# Altium schematic sheet ui_audio.SchDoc: mcHF Pro Transceiver UI board
size A3; Author: Krassi Atanassov; CompanyName: MØNKA; Engineer: For radio amateurs experimentation, non-commercial use only. Thank you!; Revision: 0.8.5; SheetTotal: 13
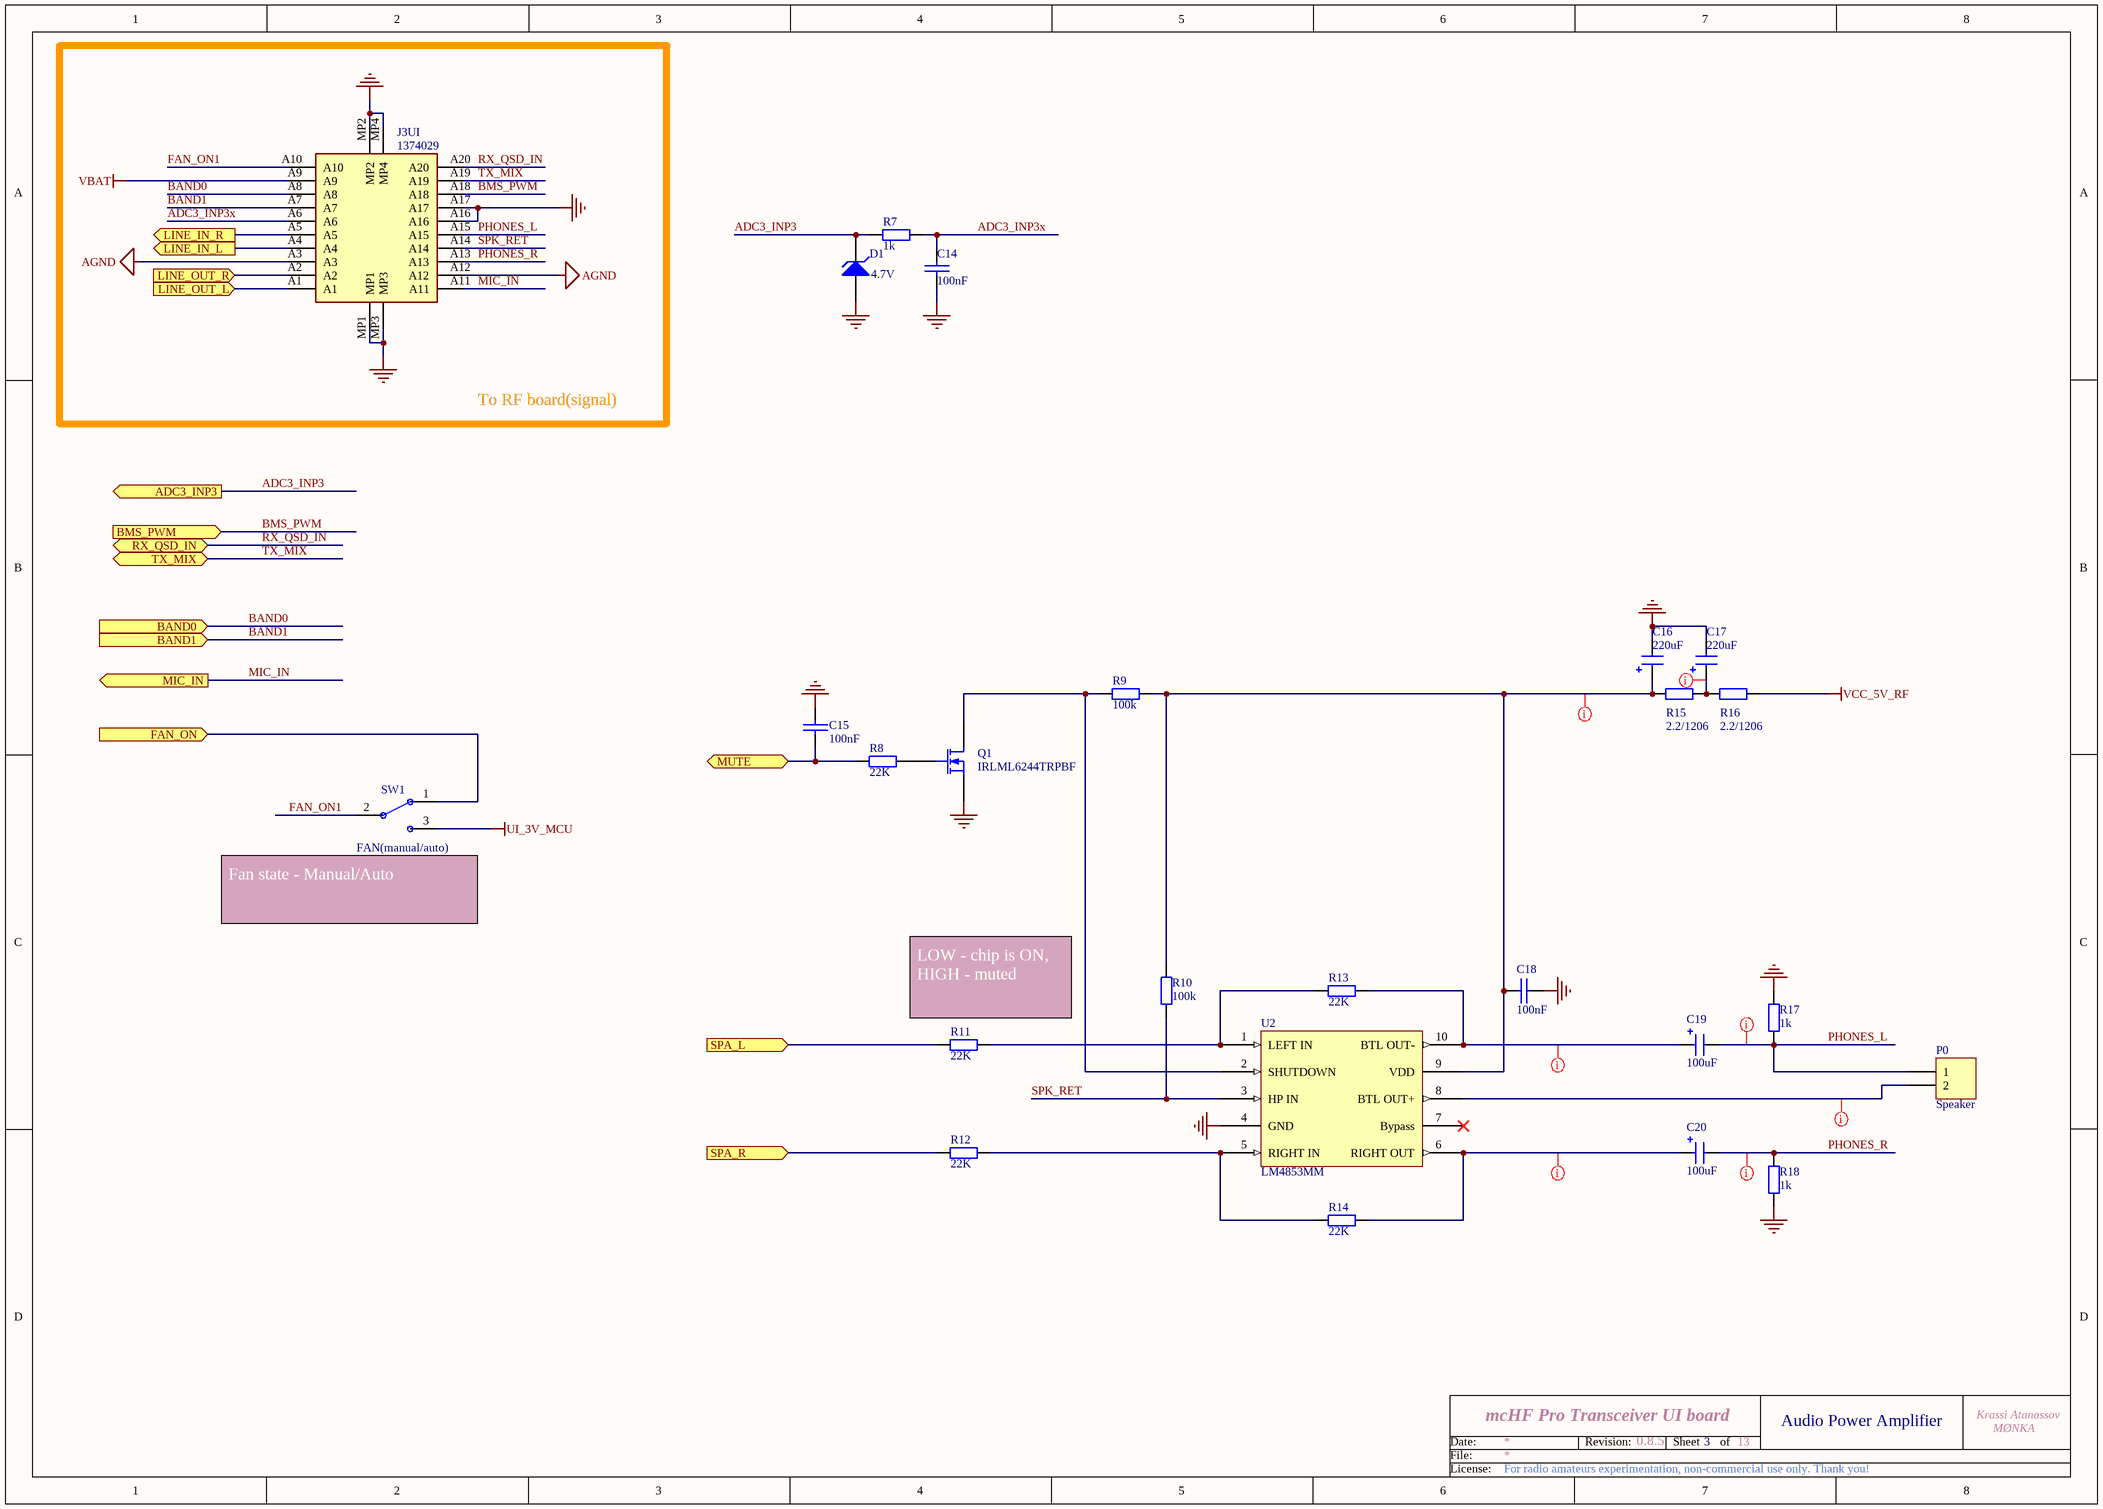
[diagram p0: ui_audio.SchDoc]

## Parts
C14  100nF  [0805]
C15  100nF  [0805]
C16  220uF  [CAP_ALUM_Pro]
C17  220uF  [CAP_ALUM_Pro]
C18  100nF  [0805]
C19  100uF  [CAP_ALUM_Pro]
C20  100uF  [CAP_ALUM_Pro]
D1  4.7V  [0805P]
J3UI  1374029  [1373866]
P0  Speaker  [MHDR1X2_m]
Q1  IRLML6244TRPBF  [SOT-23]
R7  1k  [0805]
R8  22K  [0805]
R9  100k  [0805]
R10  100k  [0805]
R11  22K  [0805]
R12  22K  [0805]
R13  22K  [0805]
R14  22K  [0805]
R15  2.2/1206  [1206]
R16  2.2/1206  [1206]
R17  1k  [0805]
R18  1k  [0805]
SW1  FAN(manual/auto)  [SW3]
U2  LM4853MM  [SLAB-MSOP-10_N]

## Blocks framed on the sheet
To RF board(signal): J3UI

## Ports
ADC3_INP3 (out), BAND0 (in), BAND1 (in), BMS_PWM (in), FAN_ON (in), LINE_IN_L (out), LINE_IN_R (out), LINE_OUT_L (in), LINE_OUT_R (in), MIC_IN (out), MUTE (bidir), RX_QSD_IN (bidir), SPA_L (in), SPA_R (in), TX_MIX (bidir)

## Nets
AGND: J3UI.A3 J3UI.A12
GND: C14.1 C15.1 C16.2 C17.2 C18.1 D1.1(A) J3UI.A16 J3UI.A17 J3UI.MP1 J3UI.MP2 J3UI.MP3 J3UI.MP4 Q1.2(S) R17.2 R18.1 U2.4(GND)
UI_3V_MCU: SW1.3
VBAT: J3UI.A9
VCC_5V_RF: R16.1
ADC3_INP3: D1.2(K) R7.2 ; port ADC3_INP3
ADC3_INP3x: C14.2 J3UI.A6 R7.1
BAND0: J3UI.A8 ; port BAND0
BAND1: J3UI.A7 ; port BAND1
BMS_PWM: J3UI.A18 ; port BMS_PWM
FAN_ON: SW1.1 ; port FAN_ON
FAN_ON1: J3UI.A10 SW1.2
LINE_IN_L: J3UI.A4 ; port LINE_IN_L
LINE_IN_R: J3UI.A5 ; port LINE_IN_R
LINE_OUT_L: J3UI.A1 ; port LINE_OUT_L
LINE_OUT_R: J3UI.A2 ; port LINE_OUT_R
MIC_IN: J3UI.A11 ; port MIC_IN
MUTE: C15.2 R8.2 ; port MUTE
PHONES_L: C19.2 J3UI.A15 P0.1 R17.1
PHONES_R: C20.2 J3UI.A13 R18.2
RX_QSD_IN: J3UI.A20 ; port RX_QSD_IN
SPA_L: R11.2 ; port SPA_L
SPA_R: R12.2 ; port SPA_R
SPK_RET: J3UI.A14 R10.2 U2.3(HP_IN)
TX_MIX: J3UI.A19 ; port TX_MIX
NetC16_1: C16.1 C18.2 R9.1 R10.1 R15.2 U2.9(VDD)
NetC17_1: C17.1 R15.1 R16.2
NetC19_1: C19.1 R13.1 U2.10(BTL_OUT-)
NetC20_1: C20.1 R14.1 U2.6(RIGHT_OUT)
NetP0_2: P0.2 U2.8(BTL_OUT+)
NetQ1_1: Q1.1(G) R8.1
NetQ1_3: Q1.3(D) R9.2 U2.2(SHUTDOWN)
NetR11_1: R11.1 R13.2 U2.1(LEFT_IN)
NetR12_1: R12.1 R14.2 U2.5(RIGHT_IN)

Not connected (* = marked no-connect by the designer): U2 7(Bypass)*

## Layout directives
rule Width Constraint [Pref Width = 12mil    Min Width = 12mil    Max Width = 12mil]: NetC16_1, NetC17_1, NetC19_1, NetC20_1, NetP0_2
rule Width Constraint [Pref Width = 10mil    Min Width = 10mil    Max Width = 10mil]: PHONES_L, PHONES_R

## Notes on the sheet
- (near SW1) Fan state - Manual/Auto
- (near R11) LOW - chip is ON, HIGH - muted
- 3
- Audio Power Amplifier
- Date:
- File:
- Revision:
- Sheet
- of
- License:

## Library data of the parts
C14 C15 C18 = CAP: Capacitor; Order: FN 252-2090; QT Order: QCC-00154; Price: 0.068
C16 = CAP-POL: Electrolitic capacitor; Notes: Aluminium capacitor; Price: 0.34
C17 C20 = CAP-POL: Electrolitic capacitor; Order: FN 225-4321; QT Order: QCC-00320; Price: 0.34
C19 = CAP-POL: Electrolitic capacitor; Order: FN 225-4321; QT Order: QCC-00320; Notes: Aluminium capacitor; Price: 0.34
D1 = D Zener: Zener Diode; Published: 8-Jun-2000; LatestRevisionDate: 17-Jul-2002; LatestRevisionNote: Re-released for DXP Platform.; PackageReference: DIODE-0.7; Publisher: Altium Limited; PackageDescription: Diode, Thru-Hole; 2 Leads; 0.7 in Pin Spacing
J3UI = 1373866: SMD male connector, nominal current: 2.2 A, Test voltage: 840 VAC, number of positions: 20, pitch: 1.27 mm, color: black, contact surface: Gold, type of contact: Male connector, mounting: SMD soldering; Manufacturer_Name: Phoenix Contact; Geometry.Height: 6.75mm; Mouser Part Number: 651-1373866; Mouser Price/Stock: https://www.mouser.co.uk/ProductDetail/Phoenix-Contact/1373866?qs=2SLPxufLcgAs0enIXKjUUw%3D%3D; Manufacturer_Part_Number: 1373866; Datasheet Link: http://www.phoenixcontact.com/gb/produkte/1373866
P0 = MHDR1X2: Header, 2-Pin; LatestRevisionDate: 17-Jul-2002; LatestRevisionNote: Re-released for DXP Platform.; Publisher: Altium Limited
Q1 = MOSFET-N: N-Channel MOSFET; QT Order: QCT-00022; QT Price: 0.28; Order: FN 186-4517; Price: 0.231
R7 = RES: Resistor; Order: FN 146-9899; QT Order: QCR-00309; Price: 0.023
R8 R11-R14 = RES: Resistor; Order: FN 188-7289; QT Order: QCR-00333; Price: 0.046
R9 R10 = RES: Resistor; Order: FN 157-6459; QT Order: QCR-00579; Price: 0.061
R15 R16 = RES: Resistor; Order: FN 207-8984; QT Order: QCR-00412; Price: 0.02
R17 R18 = RES: Resistor; Order: FN 933-2421; QT Order: QCR-00279; Price: 0.013
SW1 = SW3: Three pole switch; Order: FN 118-1070; Price: 2.19
U2 = LM4853: Mono 1.5 W / Stereo 300mW Power Amplifier; Notes: 300mW 1ch Mono, 2ch Stereo Audio Amp